# Altium project DevCard.PrjPcb
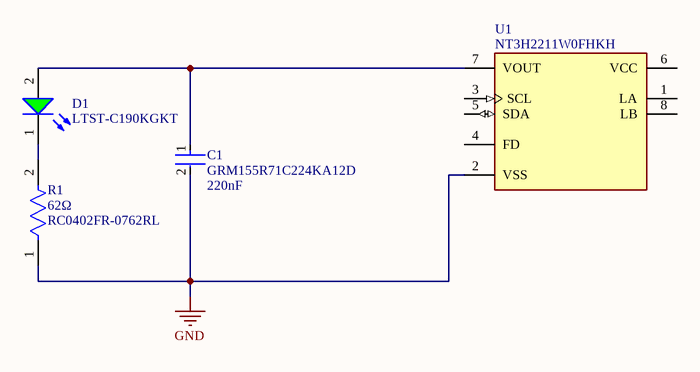
[diagram p0: DevCard_V1.SchDoc]
1 sheet, 4 parts. Net scope: global (net labels, ports and power ports of the same name join across sheets).
Board file: DevCard.PcbDoc

## Sheet DevCard_V1.SchDoc: DevCard V1
size A3; Date: *******; ApprovedBy: *******; CheckedBy: None; Author: *******; CompanyName: *******; DrawnBy: Name; Engineer: *******; Organization: *******; Address1: *******; Address2: *******; Address3: *******; Address4: *******; DocumentNumber: Doc Num; Revision: *******; SheetNumber: 1; SheetTotal: 1; CurrentTime: *******; CurrentDate: *******; Time: *******; DocumentFullPathAndName: *******; DocumentName: *******; ModifiedDate: *******; ProjectName: *******; Application_BuildNumber: *******

### Parts
C1  Capacitance: 220nF  [GRM155-0402-MFG]  (hidden comment: GRM155R71C224KA12D)
D1  LTST-C190KGKT  [FP-LTST-C190KGKT-MFG]
R1  Resistance: 62Ω  [RC0402-MFG]  (hidden comment: RC0402FR-0762RL)
U1  NT3H2211W0FHKH  [FP-SOT902-3-MFG]

### Nets
GND: C1.2 R1.1 U1.2(VSS)
NetC1_1: C1.1 D1.2(A) U1.7(VOUT)
NetD1_1: D1.1(K) R1.2

Not connected (* = marked no-connect by the designer): U1 1(LA) 3(SCL) 4(FD) 5(SDA) 6(VCC) 8(LB)

### Notes on the sheet
- Title:
- Drawn By:
- Page Contents:
- Checked By:
- Size:
- Date:
- File:
- License:
- Email:
- A4
- Number:
- Time:
- Revision:
- Sheet
- Website:
- of

### Library data of the parts
C1 = GRM155R71C224KA12D: 220nF 0402 Multilayer Ceramic Capacitor; LCSC Part Number: C77011; Manufacturer Part Number: GRM155R71C224KA12D
D1 = LTST-C190KGKT: LED Emerald 2V 0603; Color: Green; Forward Voltage: 2V; LCSC Part Number: C125094; Manufacturer Part Number: LTST-C190KGKT
R1 = RC0402FR-0762RL: 62Ω 0402 Chip Resistor; LCSC Part Number: C274896; Manufacturer Part Number: RC0402FR-0762RL
U1 = CMP-10146-000001-1: IC RFID TRANSP 13.56MHZ 8XQFN; Interface: I2C; Max Operating Temperature: 105°C; Lead Free: Lead Free; Packaging: Tape and Reel; Min Operating Temperature: -40°C; Frequency: 13.56MHz